# EasyEDA Pro project 新Exlink多功能调试器.epro, schematic 信号板
Board Name: 信号板; Create Date: 2024-08-24
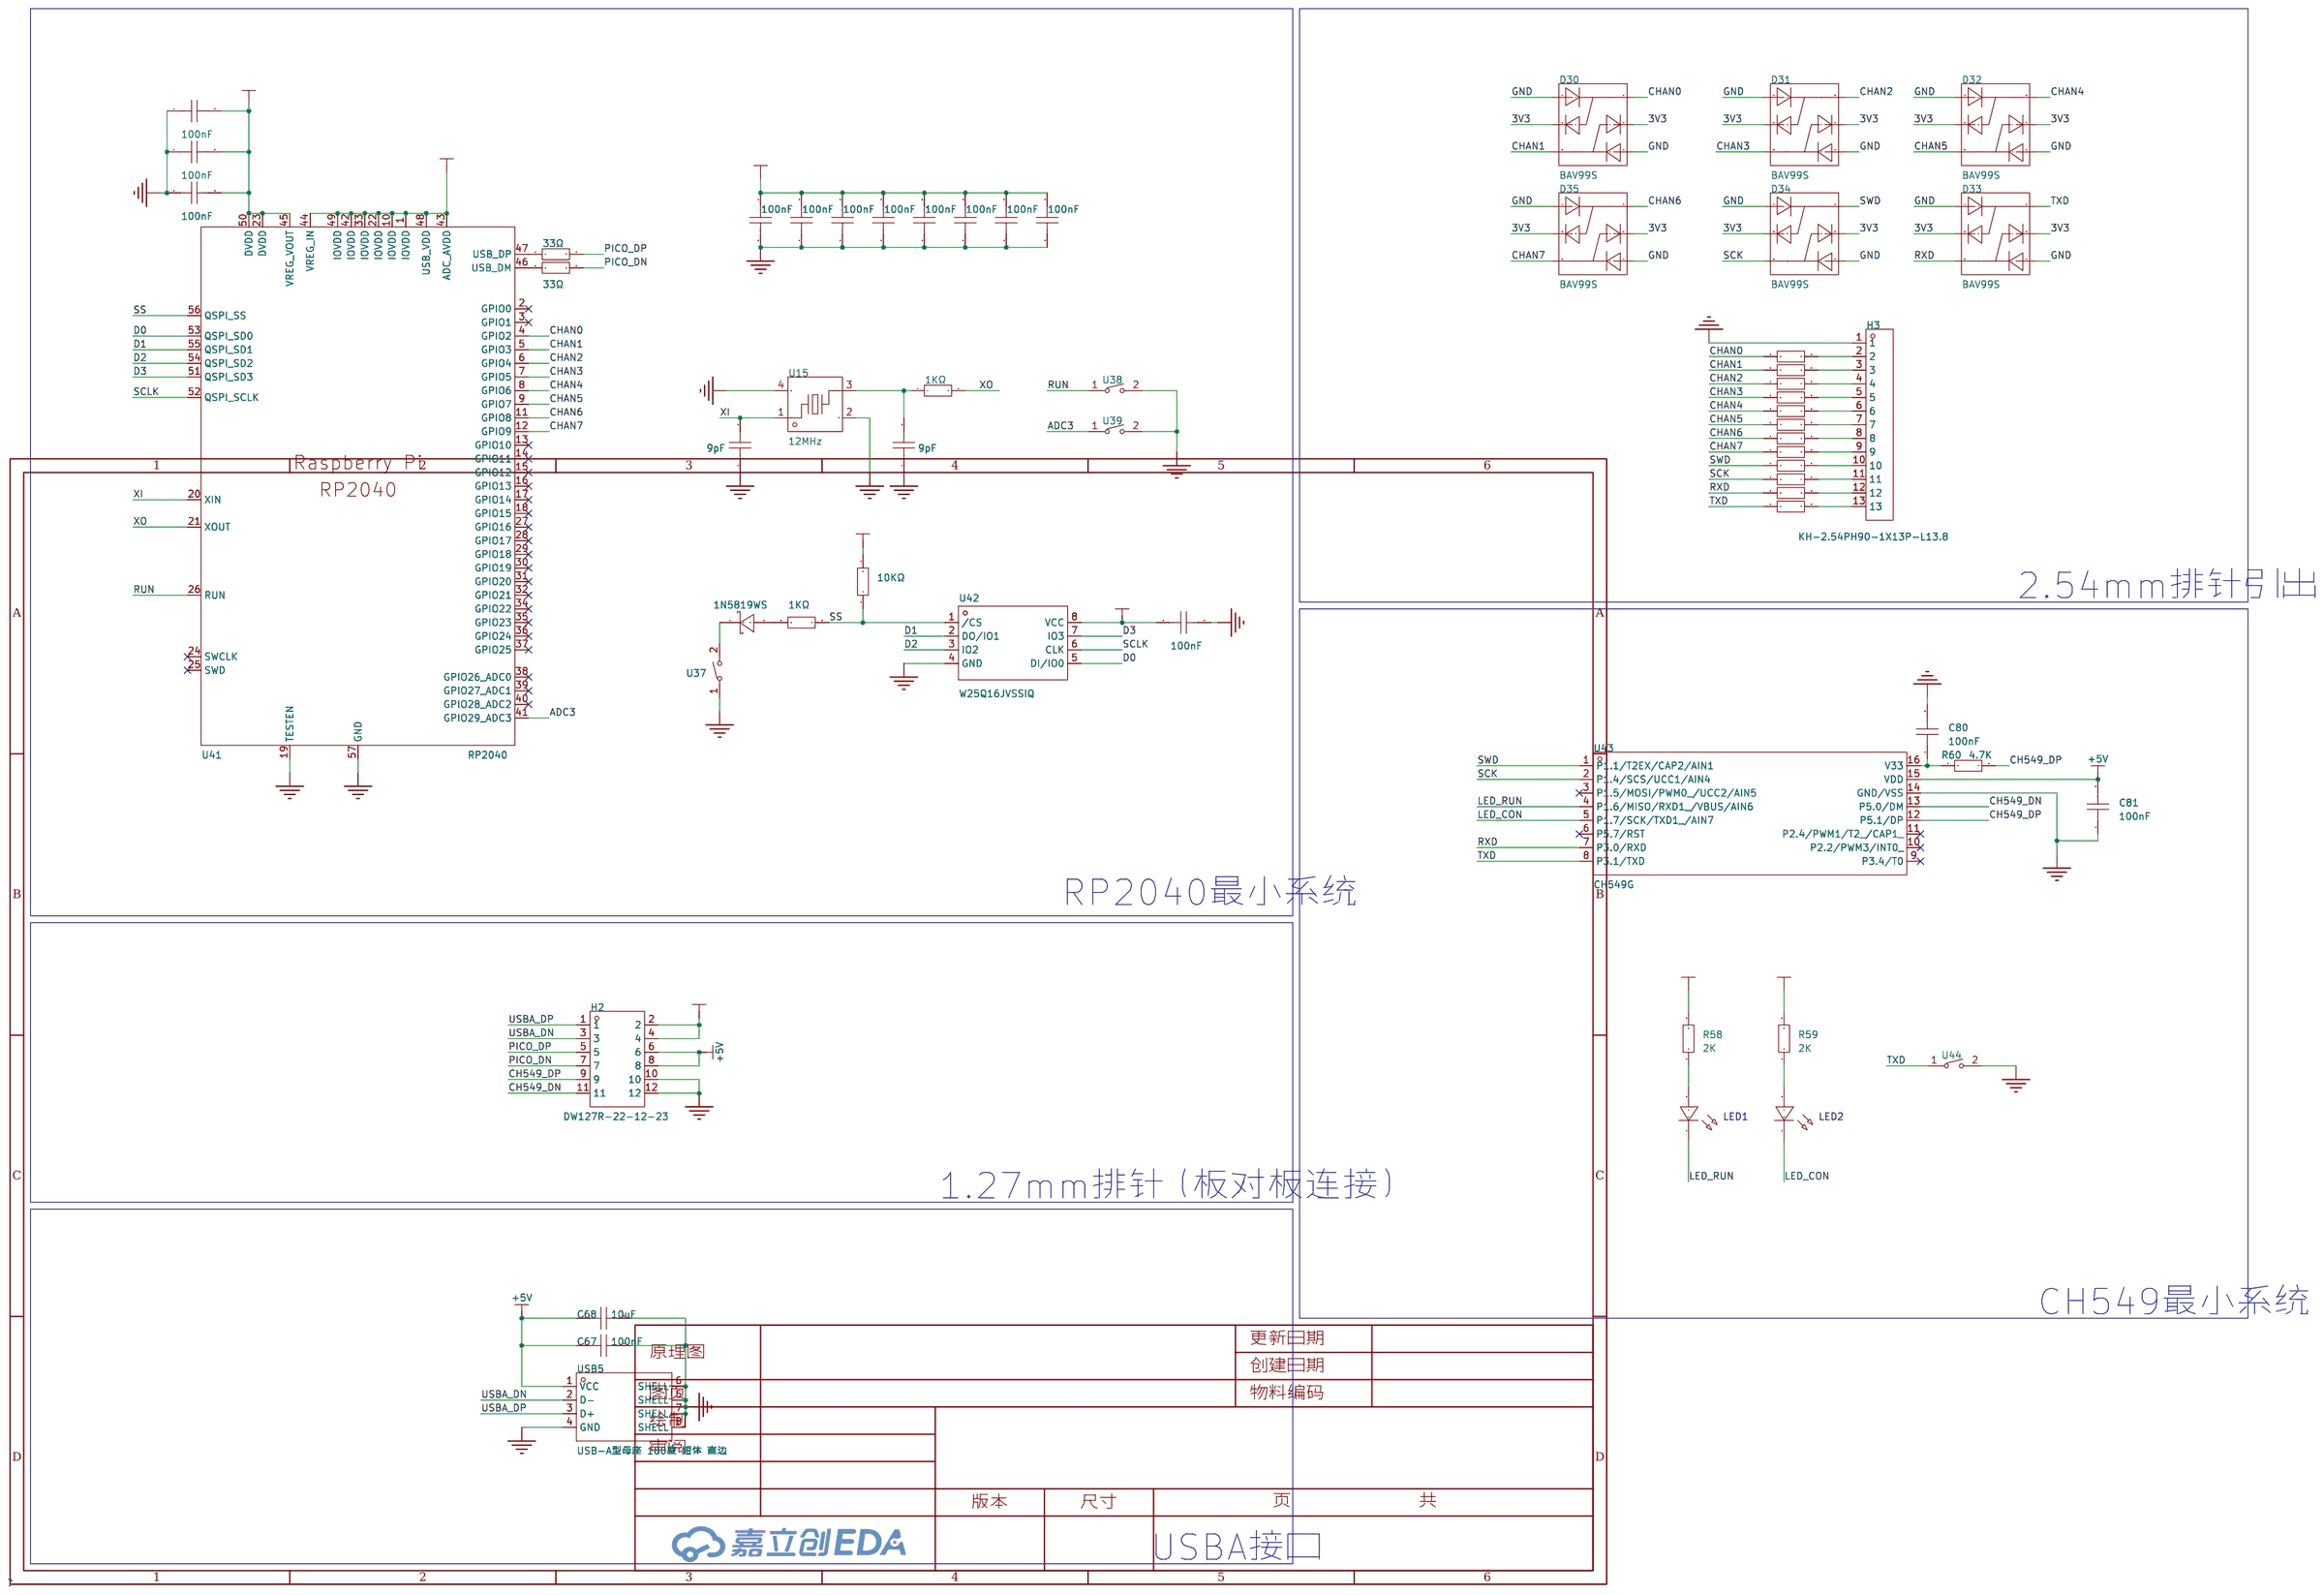
[diagram p0: schematic sheet]

## Parts
C24  9pF  [C0402]
C25  9pF  [C0402]
C26  100nF  [C0402]
C67  100nF  [C0402]
C68  10uF  [C0402]
C69  100nF  [C0402]
C70  100nF  [C0402]
C71  100nF  [C0402]
C72  100nF  [C0402]
C73  100nF  [C0402]
C74  100nF  [C0402]
C75  100nF  [C0402]
C76  100nF  [C0402]
C77  100nF  [C0402]
C78  100nF  [C0402]
C79  100nF  [C0402]
C80  100nF  [C0402]
C81  100nF  [C0402]
D29  1N5819WS  [SOD-323_L1.8-W1.3-LS2.5-RD]
D30  BAV99S  [SOT-363_L2.1-W1.3-P0.65-LS2.3-BL]
D31  BAV99S  [SOT-363_L2.1-W1.3-P0.65-LS2.3-BL]
D32  BAV99S  [SOT-363_L2.1-W1.3-P0.65-LS2.3-BL]
D33  BAV99S  [SOT-363_L2.1-W1.3-P0.65-LS2.3-BL]
D34  BAV99S  [SOT-363_L2.1-W1.3-P0.65-LS2.3-BL]
D35  BAV99S  [SOT-363_L2.1-W1.3-P0.65-LS2.3-BL]
H2  DW127R-22-12-23  [HDR-TH_12P-P1.27-V-M-R2-C6-S1.27-1]
H3  KH-2.54PH90-1X13P-L13.8  [HDR-TH_13P-P2.54-H-M-W10.4-N]
LED1  -  [LED_0402]
LED2  -  [LED_0402]
R3  33Ω  [R0402]
R4  33Ω  [R0402]
R5  10KΩ  [R0402]
R6  1KΩ  [R0402]
R20  1KΩ  [R0402]
R46  33Ω  [R0402]
R47  33Ω  [R0402]
R48  33Ω  [R0402]
R49  33Ω  [R0402]
R50  33Ω  [R0402]
R51  33Ω  [R0402]
R52  33Ω  [R0402]
R53  33Ω  [R0402]
R54  33Ω  [R0402]
R55  33Ω  [R0402]
R56  33Ω  [R0402]
R57  33Ω  [R0402]
R58  2K  [R0402]
R59  2K  [R0402]
R60  4.7K  [R0402]
U15  12MHz  [CRYSTAL-SMD_4P-L3.2-W2.5-BL]
U37  TC-S3403-2.0-260G  [SW-SMD_L4.0-W3.0-LS5.0]
U38  TC-S3403-2.0-260G  [SW-SMD_L4.0-W3.0-LS5.0]
U39  TC-S3403-2.0-260G  [SW-SMD_L4.0-W3.0-LS5.0]
U41  RP2040  [LQFN-56_L7.0-W7.0-P0.4-EP]
U42  W25Q16JVSSIQ  [SOIC-8_L5.3-W5.3-P1.27-LS8.0-BL]
U43  CH549G  [SOP-16_L10.0-W3.9-P1.27-LS6.0-BL]
U44  TC-S3403-2.0-260G  [SW-SMD_L4.0-W3.0-LS5.0]
USB5  USB-A型母座 180度 短体 直边  [USB-A-SMD_WT_C9900004571]

## Library data of the parts
C24 C25 = CC0201MRX5R6BB224: 容值:220nF;精度:±20%;额定电压:10V;材质(温度系数):X5R;; LCSC Part Name: 220nF ±20% 10V; Supplier Part: C190189; Manufacturer: YAGEO(国巨); Supplier Footprint: 0201; Datasheet: https://atta.szlcsc.com/upload/public/pdf/source/20181008/C309506_01C87B2C86DBD1236B532041A9B60642.pdf; Supplier: LCSC; Tolerance: ±20%; Voltage Rated: 10V; Temperature Coefficient: X5R
C26 C69-C79 = 0201X104K100NT: 容值:100nF;精度:±10%;额定电压:10V;材质(温度系数):X5R;; LCSC Part Name: 100nF ±10% 10V; Supplier Part: C284966; Manufacturer: FH(风华); Supplier Footprint: 0201; JLCPCB Part Class: 扩展库; Datasheet: https://atta.szlcsc.com/upload/public/pdf/source/20180917/C284966_691DE3C5BF759D23F11C92F3D90121F8.pdf; Supplier: LCSC; Tolerance: ±10%; Voltage Rated: 10V; Temperature Coefficient: X5R
C67 C68 C80 C81 = CAP_0402: Supplier Footprint: 0402
D29 = 1N5819WS_C191023: 正向压降(Vf):600mV@1A;直流反向耐压(Vr):40V;平均整流电流(Io):1A;; LCSC Part Name: 电压:40V 电流:1A; Supplier Part: C191023; Manufacturer: Hottech(合科泰); Supplier Footprint: SOD-323; JLCPCB Part Class: 基础库; Datasheet: https://atta.szlcsc.com/upload/public/pdf/source/20220428/3CB86FD8D28D653594B4E35F9D5AEFD9.pdf; Supplier: LCSC; Forward Voltage (Vf@If): 600mV@1A; Reverse Voltage (Vr): 40V; Average Rectified Current (Io): 1A
D30-D35 = BAV99S: 二极管配置:2对串联式;正向压降(Vf):1.25V@150mA;直流反向耐压(Vr):85V;平均整流电流(Io):150mA;功率:200mW;反向恢复时间(trr):6ns;; LCSC Part Name: 电压:85V 电流:150mA; Supplier Part: C68987; Manufacturer: CJ(江苏长电/长晶); Supplier Footprint: SOT-363; JLCPCB Part Class: 扩展库; Datasheet: https://atta.szlcsc.com/upload/public/pdf/source/20160516/1463363920524.pdf; Supplier: LCSC; Diode Configuration: 2对串联式; Forward Voltage (Vf@If): 1.25V@150mA; Reverse Voltage (Vr): 85V; Average Rectified Current (Io): 150mA; Power Dissipation: 200mW; Reverse Leakage Current: 1uA@75V; Reverse Recovery Time (trr): 6ns
H2 = DW127R-22-12-23: 插针结构:2x6P;间距:1.27mm;行距:1.27mm;圆针/方针:方针;安装类型:直插;排数:双排;总PIN位数:12P;额定电流:1A;额定电压:-;配合针长度:3mm;塑高:1mm;端接针长度:2.3mm;工作温度范围:-;颜色:-;; LCSC Part Name: 间距:1.27mm 2x6P 直插 方针; Supplier Part: C2935954; Manufacturer: DEALON(德艺隆); Supplier Footprint: 插件,P=1.27mm; JLCPCB Part Class: 扩展库; Datasheet: https://atta.szlcsc.com/upload/public/pdf/source/20220110/33FE2FFCEFD15AF13AB1987E70EA4ABA.pdf; Supplier: LCSC; Pin Structure: 2x6P; Pitch: 1.27mm; Row Spacing: 1.27mm; Circluar Pins/Square Pins: 方针; Mounting Type: 直插; Number of Rows: 双排; Number of Pins: 12P; Current Rating (Max): 1A; Length of Mating Pin: 3mm; Insulation Height: 1mm; Length of End Connection Pin: 2.3mm
H3 = KH-2.54PH90-1X13P-L13.8: 插针结构:1x13P;间距:2.54mm;行距:-;圆针/方针:方针;安装类型:弯插;排数:单排;总PIN位数:13P;额定电流:3A;额定电压:-;配合针长度:6mm;塑高:2.5mm;端接针长度:-;工作温度范围:-40℃~+105℃;颜色:黑色;; LCSC Part Name: 间距:2.54mm 1x13P 弯插 方针; Supplier Part: C2932694; Manufacturer: kinghelm(金航标); Supplier Footprint: 弯插,P=2.54mm; JLCPCB Part Class: 扩展库; Datasheet: https://atta.szlcsc.com/upload/public/pdf/source/20211220/56DAC73D7461283ED3EEF54E5429CBF7.pdf; Supplier: LCSC; Pin Structure: 1x13P; Pitch: 2.54mm; Circluar Pins/Square Pins: 方针; Mounting Type: 弯插; Number of Rows: 单排; Number of Pins: 13P; Current Rating (Max): 3A; Length of Mating Pin: 6mm; Insulation Height: 2.5mm; Operating Temperature Range: -40℃~+105℃; Color: 黑色
LED1 LED2 = LED_0603-G: Supplier Footprint: 0603
R3-R6 R20 R46-R57 R60 = RC0201FR-072R2L: 电阻类型:厚膜电阻;阻值:2.2Ω;精度:±1%;功率:50mW;; LCSC Part Name: 2.2Ω ±1% 50mW; Supplier Part: C138154; Manufacturer: YAGEO(国巨); Supplier Footprint: 0201; JLCPCB Part Class: 扩展库; Datasheet: https://atta.szlcsc.com/upload/public/pdf/source/20171107/C138154_15100517264731097049.pdf; Supplier: LCSC; Type: 厚膜电阻; Tolerance: ±1%; Power(Watts): 50mW; Temperature Coefficient: -100ppm/℃~+350ppm/℃; Overload Voltage (Max): 25V; Operating Temperature Range: -55℃~+125℃
R58 R59 = Res_0402: Supplier Footprint: 0402
U15 = L327S400H11L: 晶振类型:贴片晶振;频率:40MHz;常温频差:±10ppm;外接负载电容:10pF;; LCSC Part Name: 40MHz ±10ppm 10pF; Supplier Part: C5261245; Manufacturer: Lucki(蓝晶); Supplier Footprint: SMD3225-4P; Datasheet: https://atta.szlcsc.com/upload/public/pdf/source/20221202/3BD521BEB23A8C516134756D2665894B.pdf; Supplier: LCSC; Crystal Type: 贴片晶振; Normal temperature Frequency Tolerance: ±10ppm; External load capacitor: 10pF; Operating Temperature: -40℃~+85℃
U37-U39 U44 = TC-S3403-2.0-260G: 连接器类型：3.5mm耳机座 额定电流：500mA 额定电压：30V 工作温度范围：-20℃~+70℃ 焊接温度(最大值)：235℃ 3.5音频连接器 5脚3级插脚 音响耳机插座; Supplier Part: C5372844; Manufacturer: HCTL(华灿天禄); Supplier Footprint: SMD; Datasheet: https://atta.szlcsc.com/upload/public/pdf/source/20230320/549E467C3F97F31F1E4EF0A0B79060CE.pdf; Supplier: LCSC
U41 = RP2040_C2040: CPU内核:-;RAM总容量:264KB;GPIO端口数量:30;工作电压范围:-;CPU最大主频:133MHz;程序存储器类型:-;应用领域:-;; LCSC Part Name: RP2040（RP2B2）; Supplier Part: C2040; Manufacturer: Raspberry Pi(树莓派); Supplier Footprint: LQFN-56(7x7); JLCPCB Part Class: 扩展库; Datasheet: https://atta.szlcsc.com/upload/public/pdf/source/20210621/C2040_96F425825606B7957D87DD32E2512CA9.pdf; Supplier: LCSC; RAM Size: 264KB; GPIO Ports Number: 30; CPU Maximum Speed: 133MHz; ADC (Bit): 12bit; UART/USART: 2; I2C: 2; SPI: 2; Universal Serial Bus: 有; Peripheral/Function: DMA；PWM; Direct Memory Access: 有
U42 = W25Q16JVSSIQ: 接口类型:SPI;存储容量:16Mbit;; Supplier Part: C82317; Manufacturer: WINBOND(华邦); Supplier Footprint: SOIC-8-208mil; JLCPCB Part Class: 扩展库; Datasheet: https://atta.szlcsc.com/upload/public/pdf/source/20210318/C131025_490139441AABAB3970D06D5A0D9163A5.pdf; Supplier: LCSC; Interface Type: SPI; Memory Size: 16Mbit; Supply Voltage: 2.7V~3.6V; Page Programming Time (Tpp): 3ms; Operating Temperature: -40℃~+85℃
U43 = CH549G: Supplier Part: C9900000386; Supplier Footprint: SOP-16; JLCPCB Part Class: 扩展库; Supplier: LCSC
USB5 = USB-A型母座 180度 短体 直边: Supplier Part: C9900004571; Supplier Footprint: SMD; JLCPCB Part Class: 扩展库; Supplier: LCSC

## Nets
3V3: C26.1 C69.1 C70.2 C71.2 C72.2 C73.2 C74.2 C75.2 C76.2 D30.2(K) D30.5 D31.2(K) D31.5 D32.2(K) D32.5 D33.2(K) D33.5 D34.2(K) D34.5 D35.2(K) D35.5 H2.2 H2.4 R5.2 R58.2 R59.2 U41.1(IOVDD) U41.10(IOVDD) U41.22(IOVDD) U41.33(IOVDD) U41.42(IOVDD) U41.43(ADC_AVDD) U41.44(VREG_IN) U41.48(USB_VDD) U41.49(IOVDD) U42.8(VCC)
+1V: C77.2 C78.2 C79.2 U41.23(DVDD) U41.45(VREG_VOUT) U41.50(DVDD)
+5V: C67.1 C68.1 C81.2 H2.6 H2.8 U43.15(VDD) USB5.1(VCC)
GND: C24.1 C25.1 C26.2 C67.2 C68.2 C69.2 C70.1 C71.1 C72.1 C73.1 C74.1 C75.1 C76.1 C77.1 C78.1 C79.1 C80.2 C81.1 D30.1(A) D30.4 D31.1(A) D31.4 D32.1(A) D32.4 D33.1(A) D33.4 D34.1(A) D34.4 D35.1(A) D35.4 H2.10 H2.12 H3.1 U15.2(GND) U15.4(GND) U37.1 U38.2 U39.2 U41.19(TESTEN) U41.57(GND) U42.4(GND) U43.14(GND/VSS) U44.2 USB5.4(GND) USB5.5(SHELL) USB5.6(SHELL) USB5.7(SHELL) USB5.8(SHELL)
ADC3: U39.1 U41.41(GPIO29_ADC3)
CH549_DN: H2.11 U43.13(P5.0/DM)
CH549_DP: H2.9 R60.2 U43.12(P5.1/DP)
CHAN0: D30.3 R46.1 U41.4(GPIO2)
CHAN1: D30.6 R47.1 U41.5(GPIO3)
CHAN2: D31.3 R48.1 U41.6(GPIO4)
CHAN3: D31.6 R49.1 U41.7(GPIO5)
CHAN4: D32.3 R50.1 U41.8(GPIO6)
CHAN5: D32.6 R51.1 U41.9(GPIO7)
CHAN6: D35.3 R52.1 U41.11(GPIO8)
CHAN7: D35.6 R53.1 U41.12(GPIO9)
D0: U41.53(QSPI_SD0) U42.5(DI/IO0)
D1: U41.55(QSPI_SD1) U42.2(DO/IO1)
D2: U41.54(QSPI_SD2) U42.3(IO2)
D3: U41.51(QSPI_SD3) U42.7(IO3)
LED_CON: LED2.1(C) U43.5(P1.7/SCK/TXD1_/AIN7)
LED_RUN: LED1.1(C) U43.4(P1.6/MISO/RXD1_/VBUS/AIN6)
PICO_DN: H2.7 R4.2
PICO_DP: H2.5 R3.2
RUN: U38.1 U41.26(RUN)
RXD: D33.6 R56.1 U43.7(P3.0/RXD)
SCK: D34.6 R55.1 U43.2(P1.4/SCS/UCC1/AIN4)
SCLK: U41.52(QSPI_SCLK) U42.6(CLK)
SS: R5.1 R6.2 U41.56(QSPI_SS) U42.1(/CS)
SWD: D34.3 R54.1 U43.1(P1.1/T2EX/CAP2/AIN1)
TXD: D33.3 R57.1 U43.8(P3.1/TXD) U44.1
USBA_DN: H2.3 USB5.2(D-)
USBA_DP: H2.1 USB5.3(D+)
XI: C25.2 U15.1 U41.20(XIN)
XO: R20.2 U41.21(XOUT)
$1N3717: C24.2 R20.1 U15.3
$1N3739: D29.2(A) R6.1
$1N4612: D29.1(K) U37.2
$1N6399: R3.1 U41.47(USB_DP)
$1N6401: R4.1 U41.46(USB_DM)
$1N7068: H3.2 R46.2
$1N7111: H3.3 R47.2
$1N7154: H3.4 R48.2
$1N7197: H3.5 R49.2
$1N7240: H3.6 R50.2
$1N7283: H3.7 R51.2
$1N7326: H3.8 R52.2
$1N7369: H3.9 R53.2
$1N7412: H3.10 R54.2
$1N7455: H3.11 R55.2
$1N7498: H3.12 R56.2
$1N7541: H3.13 R57.2
$1N10559: C80.1 R60.1 U43.16(V33)
$1N10835: LED1.2(A) R58.1
$1N10837: LED2.2(A) R59.1

Not connected (* = marked no-connect by the designer): U41 2(GPIO0)* 3(GPIO1)* 13(GPIO10)* 14(GPIO11)* 15(GPIO12)* 16(GPIO13)* 17(GPIO14)* 18(GPIO15)* 24(SWCLK)* 25(SWD)* 27(GPIO16)* 28(GPIO17)* 29(GPIO18)* 30(GPIO19)* 31(GPIO20)* 32(GPIO21)* 34(GPIO22)* 35(GPIO23)* 36(GPIO24)* 37(GPIO25)* 38(GPIO26_ADC0)* 39(GPIO27_ADC1)* 40(GPIO28_ADC2)*; U43 3(P1.5/MOSI/PWM0_/UCC2/AIN5)* 6(P5.7/RST)* 9(P3.4/T0)* 10(P2.2/PWM3/INT0_)* 11(P2.4/PWM1/T2_/CAP1_)*

## Notes on the sheet
- 2.54mm排针引出
- RP2040最小系统
- 1.27mm排针（板对板连接）
- CH549最小系统
- USBA接口
